# Altium project TOP LAYER.PrjPCB
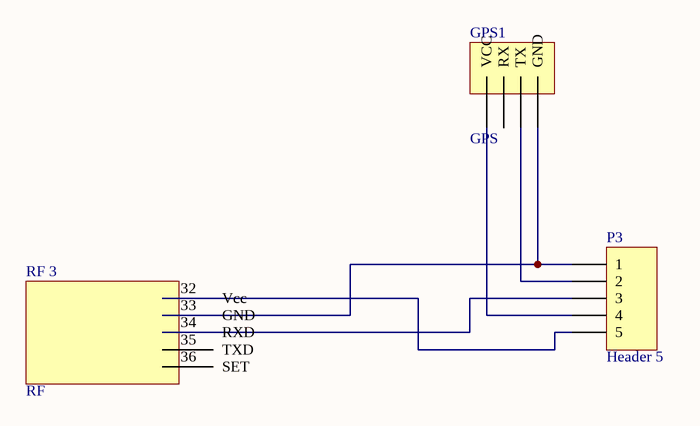
[diagram p0: TOP LAYER.SchDoc]
1 sheet, 3 parts. Net scope: global (net labels, ports and power ports of the same name join across sheets).
Board file: TOP LAYER 2.PcbDoc

## Sheet TOP LAYER.SchDoc
size A

### Parts
GPS1  GPS  [GPS]
P3  Header 5  [HDR1X5]
RF_3  RF  [RF]

### Nets
NetGPS1_12: GPS1.12(VCC) P3.4
NetGPS1_14: GPS1.14(TX) P3.2
NetGPS1_15: GPS1.15(GND) P3.1 RF_3.33(GND)
NetP3_3: P3.3 RF_3.34(RXD)
NetP3_5: P3.5 RF_3.32(Vcc)

Not connected (* = marked no-connect by the designer): GPS1 13(RX); RF_3 35(TXD) 36(SET)

### Library data of the parts
P3 = Header 5: Header, 5-Pin; LatestRevisionDate: 17-Jul-2002; LatestRevisionNote: Re-released for DXP Platform.; Publisher: Altium Limited